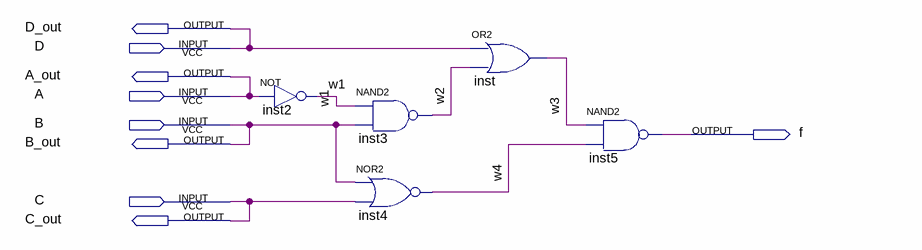
[diagram p0: schematic sheet]
// Quartus schematic Lab_1_Section_1.bdf as structural Verilog: 5 symbols, 9 pins
module Lab_1_Section_1 (
  input  D,
  input  A,
  input  B,
  input  C,
  output D_out,
  output A_out,
  output f,
  output B_out,
  output C_out
);

  wire w1, w2, w3, w4;

  not inst2 (w1, A);
  nand inst3 (w2, w1, B);
  nor inst4 (w4, B, C);
  or inst (w3, D, w2);
  nand inst5 (f, w3, w4);

  assign A_out = A;
  assign B_out = B;
  assign C_out = C;
  assign D_out = D;
endmodule
